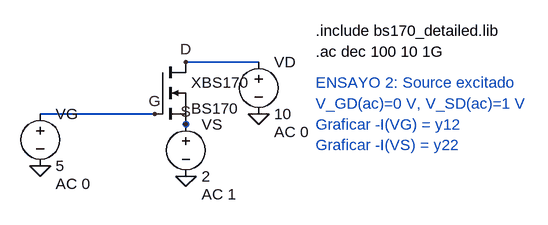
[diagram p0: schematic Simulacion_source.asc]
Simulacion_source.asc, the LTspice schematic file:
Version 4.1
SHEET 1 880 680
WIRE 512 96 400 96
WIRE 176 176 352 176
WIRE 400 192 400 192
FLAG 400 96 D
FLAG 352 176 G
FLAG 400 192 S
FLAG 176 256 0
FLAG 400 272 0
FLAG 512 176 0
SYMBOL nmos 352 96 R0
SYMATTR InstName XBS170
SYMATTR Value BS170
SYMATTR Prefix X
SYMBOL voltage 176 160 R0
WINDOW 123 24 124 Left 2
WINDOW 39 0 0 Left 0
SYMATTR InstName VG
SYMATTR Value 5
SYMATTR Value2 AC 0
SYMBOL voltage 400 176 R0
WINDOW 123 24 124 Left 2
WINDOW 39 0 0 Left 0
SYMATTR InstName VS
SYMATTR Value 2
SYMATTR Value2 AC 1
SYMBOL voltage 512 80 R0
WINDOW 123 24 124 Left 2
WINDOW 39 0 0 Left 0
SYMATTR InstName VD
SYMATTR Value 10
SYMATTR Value2 AC 0
TEXT 600 48 Left 2 !.include bs170_detailed.lib
TEXT 600 80 Left 2 !.ac dec 100 10 1G
TEXT 600 128 Left 2 ;ENSAYO 2: Source excitado
TEXT 600 160 Left 2 ;V_GD(ac)=0 V, V_SD(ac)=1 V
TEXT 600 192 Left 2 ;Graficar -I(VG) = y12
TEXT 600 224 Left 2 ;Graficar -I(VS) = y22

The netlist it stands for:
* Simulacion_source.asc
X§XBS170 D G S BS170  ; pins D G S
VG G 0 5 AC 0
VS S 0 2 AC 1
VD D 0 10 AC 0
.include bs170_detailed.lib
.ac dec 100 10 1G
* ENSAYO 2: Source excitado
* V_GD(ac)=0 V, V_SD(ac)=1 V
* Graficar -I(VG) = y12
* Graficar -I(VS) = y22
.backanno
.end

* Results of the author's LTspice run, read from the files saved beside the schematic
* Operating Point, zero values left out:
*   V(d) = 10 V
*   V(g) = 5 V
*   V(s) = 2 V
*   I(VD) = -369.5 mA
*   I(VS) = 369.5 mA
*   Ix(xbs170:1) = 369.5 mA
*   Ix(xbs170:3) = -369.5 mA
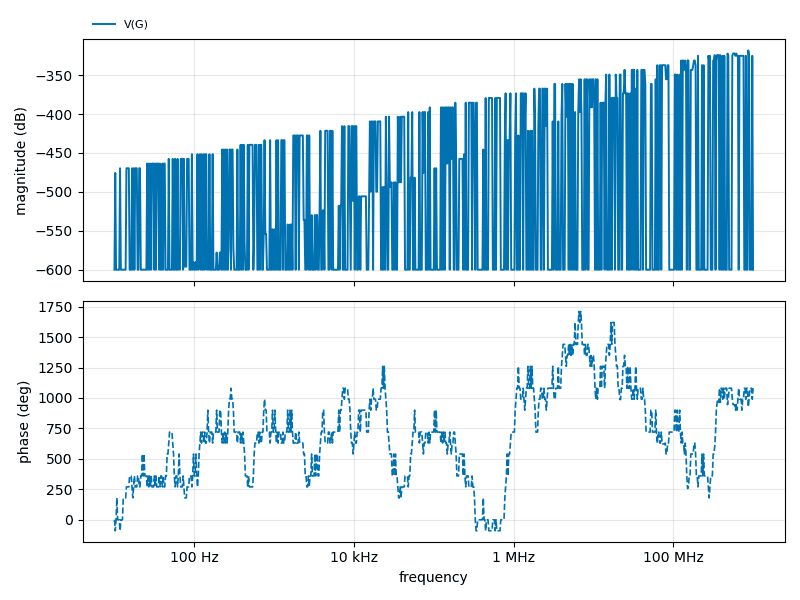
[diagram p1: AC Analysis of Simulacion_source.asc, plotted from the saved traces]
* AC Analysis, 1 run:
*   V(G): -600.00 dB at 10 Hz, -600.00 dB at 1 GHz, peak -318.12 dB at 871 MHz, 3 dB below the peak at 870.7 MHz and 879.6 MHz